# Altium schematic sheet 02 - Power Stage.SchDoc: Power Stage - 25kW WolfPACK FM3 Six-Pack Inv.
size 431 x 279 mm; Date: 07/2023; DocumentNumber: CRD25DA12N-FMC; Revision: 1.1; SheetNumber: 2; SheetTotal: 8; SheetSize: B
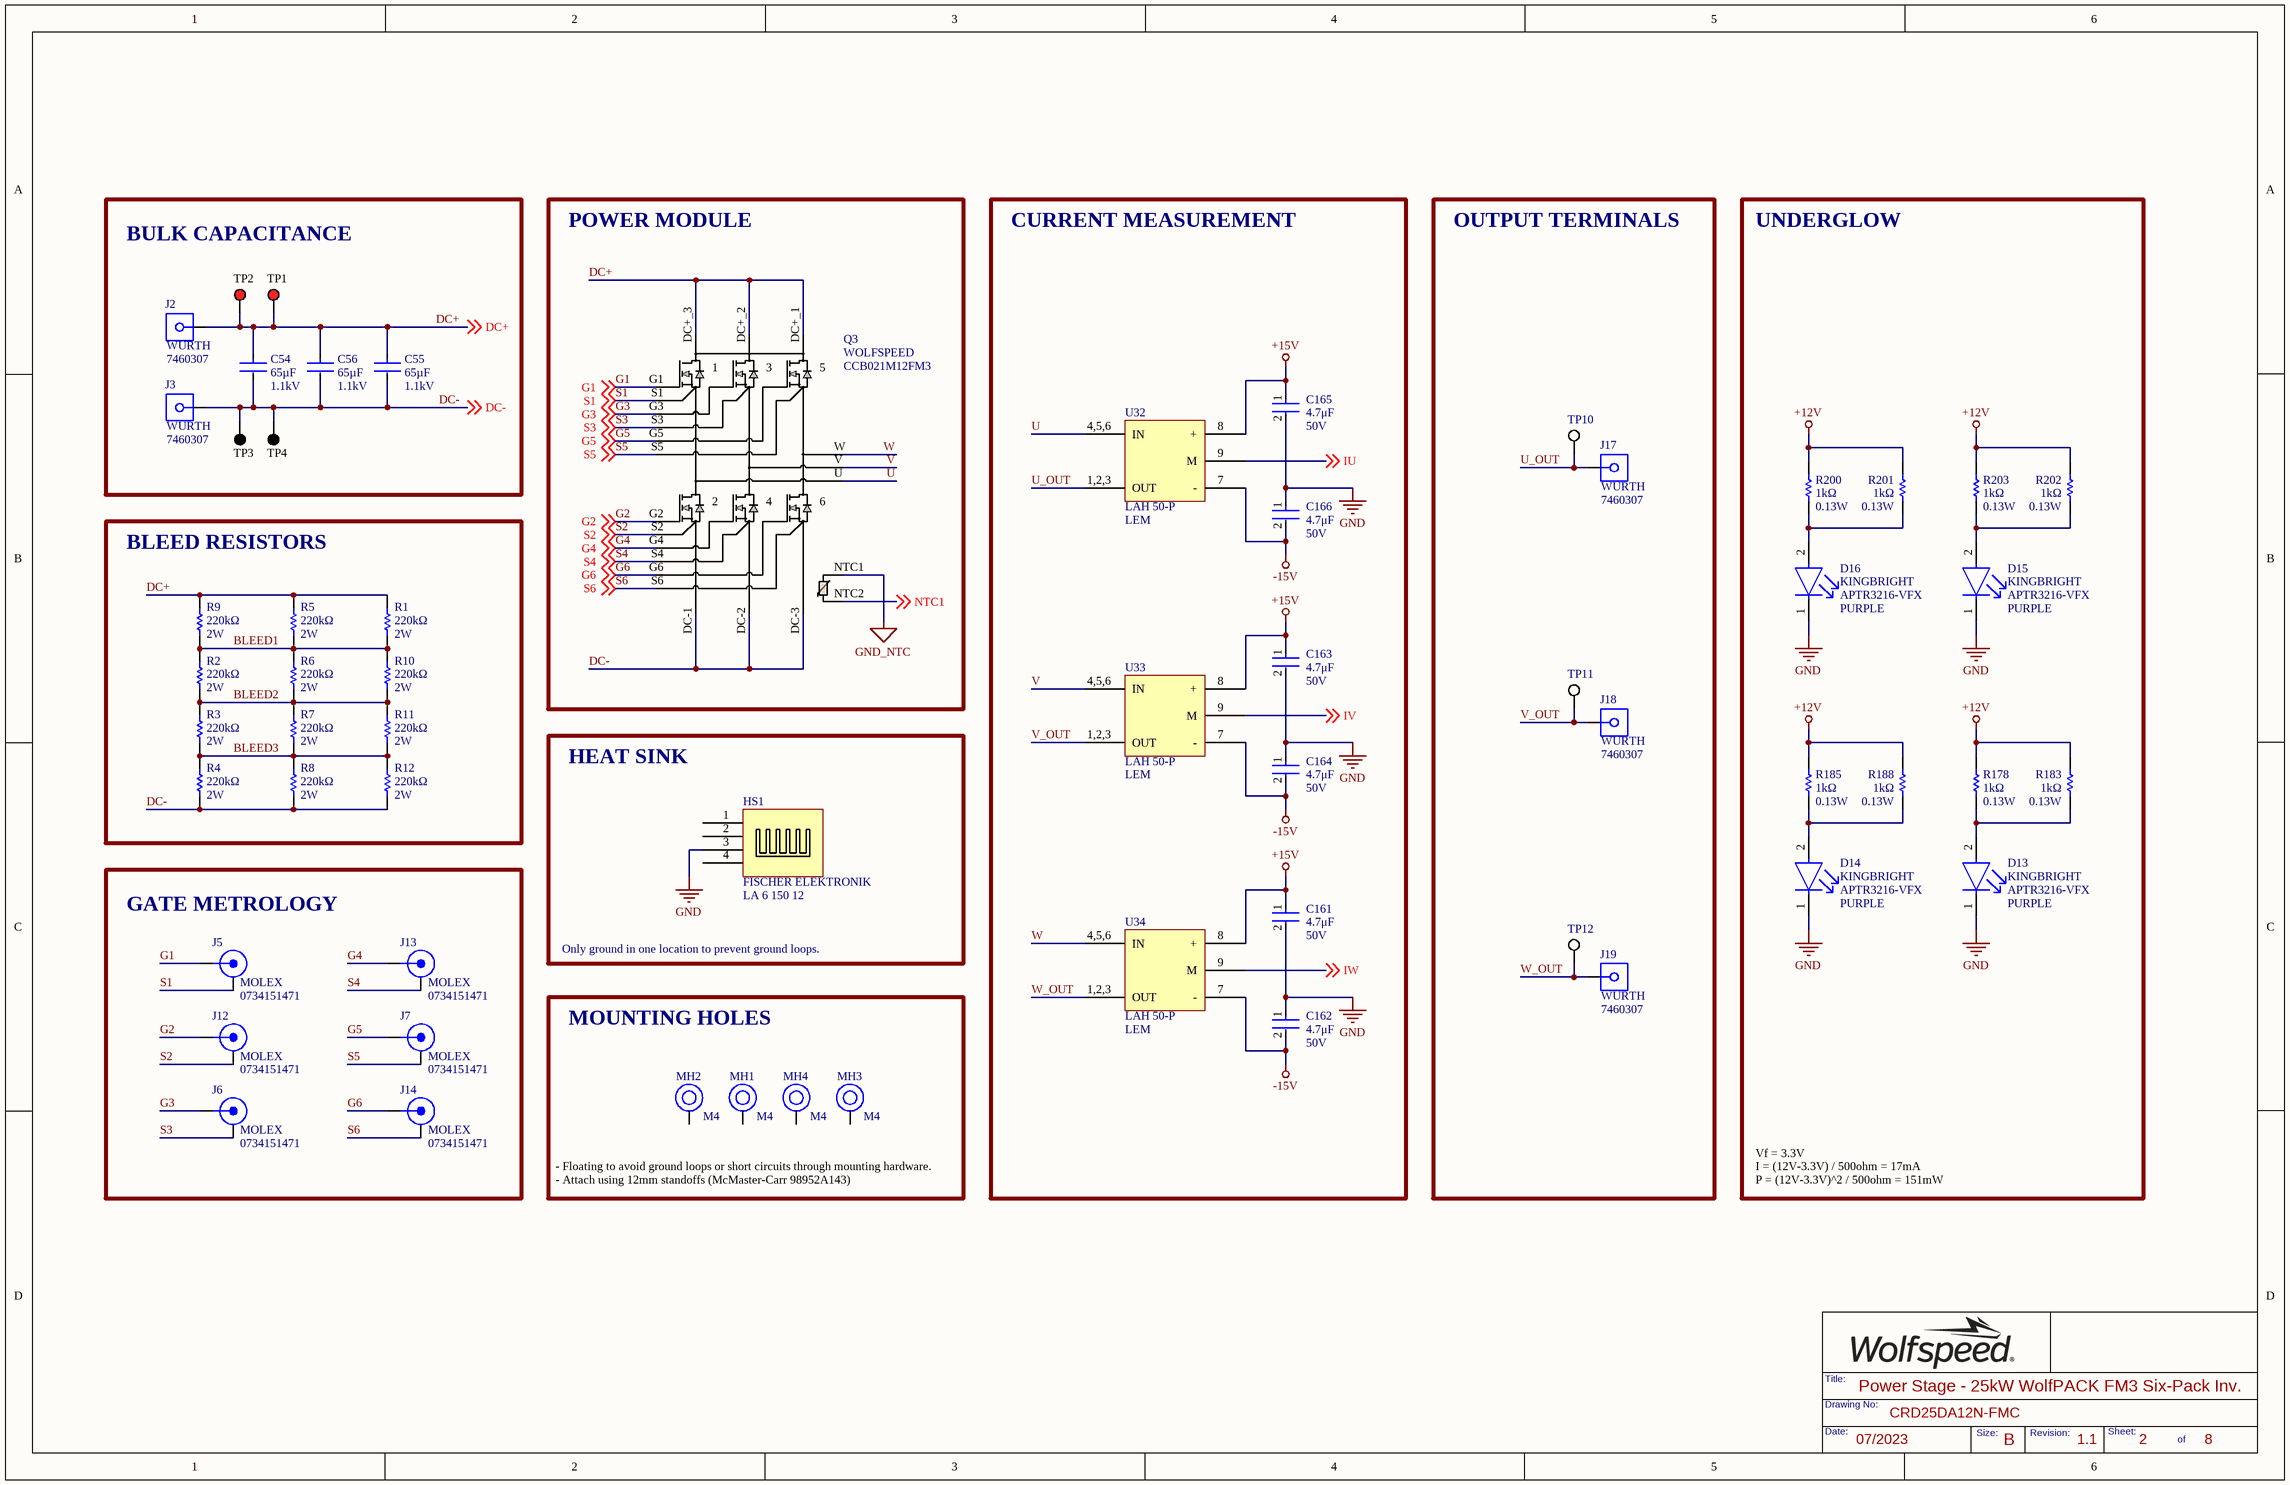
[diagram p0: 02 - Power Stage.SchDoc]

## Parts
C54  Voltage: 1.1kV  Capacitance: 65µF  [C4AQQEW5650A3BJ]  (hidden comment: C4AQQEW5650A3BJ)
C55  Voltage: 1.1kV  Capacitance: 65µF  [C4AQQEW5650A3BJ]  (hidden comment: C4AQQEW5650A3BJ)
C56  Voltage: 1.1kV  Capacitance: 65µF  [C4AQQEW5650A3BJ]  (hidden comment: C4AQQEW5650A3BJ)
C161  Voltage Rating: 50V  Capacitance: 4.7μF  [FP-CL31-IPC_C]  (hidden comment: CL31B475KBHNFNE)
C162  Voltage Rating: 50V  Capacitance: 4.7μF  [FP-CL31-IPC_C]  (hidden comment: CL31B475KBHNFNE)
C163  Voltage Rating: 50V  Capacitance: 4.7μF  [FP-CL31-IPC_C]  (hidden comment: CL31B475KBHNFNE)
C164  Voltage Rating: 50V  Capacitance: 4.7μF  [FP-CL31-IPC_C]  (hidden comment: CL31B475KBHNFNE)
C165  Voltage Rating: 50V  Capacitance: 4.7μF  [FP-CL31-IPC_C]  (hidden comment: CL31B475KBHNFNE)
C166  Voltage Rating: 50V  Capacitance: 4.7μF  [FP-CL31-IPC_C]  (hidden comment: CL31B475KBHNFNE)
D13  Manufacturer Print: KINGBRIGHT  Color: PURPLE  [FP-APTR3216SECK-MFG]  (hidden comment: APTR3216-VFX)
D14  Manufacturer Print: KINGBRIGHT  Color: PURPLE  [FP-APTR3216SECK-MFG]  (hidden comment: APTR3216-VFX)
D15  Manufacturer Print: KINGBRIGHT  Color: PURPLE  [FP-APTR3216SECK-MFG]  (hidden comment: APTR3216-VFX)
D16  Manufacturer Print: KINGBRIGHT  Color: PURPLE  [FP-APTR3216SECK-MFG]  (hidden comment: APTR3216-VFX)
HS1  LA 6 150 12  Manufacturer: FISCHER ELEKTRONIK  [LA 6 150 12]
J2  Manufacturer Print: WURTH  [7460307]  (hidden comment: 7460307)
J3  Manufacturer Print: WURTH  [7460307]  (hidden comment: 7460307)
J5  0734151471  Manufacturer Print: MOLEX  [FP-73415-1471-MFG]
J6  0734151471  Manufacturer Print: MOLEX  [FP-73415-1471-MFG]
J7  0734151471  Manufacturer Print: MOLEX  [FP-73415-1471-MFG]
J12  0734151471  Manufacturer Print: MOLEX  [FP-73415-1471-MFG]
J13  0734151471  Manufacturer Print: MOLEX  [FP-73415-1471-MFG]
J14  0734151471  Manufacturer Print: MOLEX  [FP-73415-1471-MFG]
J17  Manufacturer Print: WURTH  [7460307]  (hidden comment: 7460307)
J18  Manufacturer Print: WURTH  [7460307]  (hidden comment: 7460307)
J19  Manufacturer Print: WURTH  [7460307]  (hidden comment: 7460307)
MH1  Size: M4  [MH_M4_P]  (hidden comment: MH_M4_P)
MH2  Size: M4  [MH_M4_P]  (hidden comment: MH_M4_P)
MH3  Size: M4  [MH_M4_P]  (hidden comment: MH_M4_P)
MH4  Size: M4  [MH_M4_P]  (hidden comment: MH_M4_P)
Q3  CCB021M12FM3  Manufacturer Print: WOLFSPEED  [FM3_SIX-PACK_3PHASE_CRW]
R1  Power Rating: 2W  Resistance: 220kΩ  [FP-CRGP2512-IPC_C]  (hidden comment: CRGP2512F220K)
R2  Power Rating: 2W  Resistance: 220kΩ  [FP-CRGP2512-IPC_C]  (hidden comment: CRGP2512F220K)
R3  Power Rating: 2W  Resistance: 220kΩ  [FP-CRGP2512-IPC_C]  (hidden comment: CRGP2512F220K)
R4  Power Rating: 2W  Resistance: 220kΩ  [FP-CRGP2512-IPC_C]  (hidden comment: CRGP2512F220K)
R5  Power Rating: 2W  Resistance: 220kΩ  [FP-CRGP2512-IPC_C]  (hidden comment: CRGP2512F220K)
R6  Power Rating: 2W  Resistance: 220kΩ  [FP-CRGP2512-IPC_C]  (hidden comment: CRGP2512F220K)
R7  Power Rating: 2W  Resistance: 220kΩ  [FP-CRGP2512-IPC_C]  (hidden comment: CRGP2512F220K)
R8  Power Rating: 2W  Resistance: 220kΩ  [FP-CRGP2512-IPC_C]  (hidden comment: CRGP2512F220K)
R9  Power Rating: 2W  Resistance: 220kΩ  [FP-CRGP2512-IPC_C]  (hidden comment: CRGP2512F220K)
R10  Power Rating: 2W  Resistance: 220kΩ  [FP-CRGP2512-IPC_C]  (hidden comment: CRGP2512F220K)
R11  Power Rating: 2W  Resistance: 220kΩ  [FP-CRGP2512-IPC_C]  (hidden comment: CRGP2512F220K)
R12  Power Rating: 2W  Resistance: 220kΩ  [FP-CRGP2512-IPC_C]  (hidden comment: CRGP2512F220K)
R178  Resistance: 1kΩ  Power Rating: 0.13W  [RESC2013X50X30LL20T20]  (hidden comment: CRCW08051K00JNTA)
R183  Resistance: 1kΩ  Power Rating: 0.13W  [RESC2013X50X30LL20T20]  (hidden comment: CRCW08051K00JNTA)
R185  Resistance: 1kΩ  Power Rating: 0.13W  [RESC2013X50X30LL20T20]  (hidden comment: CRCW08051K00JNTA)
R188  Resistance: 1kΩ  Power Rating: 0.13W  [RESC2013X50X30LL20T20]  (hidden comment: CRCW08051K00JNTA)
R200  Resistance: 1kΩ  Power Rating: 0.13W  [RESC2013X50X30LL20T20]  (hidden comment: CRCW08051K00JNTA)
R201  Resistance: 1kΩ  Power Rating: 0.13W  [RESC2013X50X30LL20T20]  (hidden comment: CRCW08051K00JNTA)
R202  Resistance: 1kΩ  Power Rating: 0.13W  [RESC2013X50X30LL20T20]  (hidden comment: CRCW08051K00JNTA)
R203  Resistance: 1kΩ  Power Rating: 0.13W  [RESC2013X50X30LL20T20]  (hidden comment: CRCW08051K00JNTA)
TP1  5010  [KSTN-5010_V]  (value not drawn)
TP2  5010  [KSTN-5010_V]  (value not drawn)
TP3  5011  [KSTN-5011_V]  (value not drawn)
TP4  5011  [KSTN-5011_V]  (value not drawn)
TP10  5012  [KSTN-5012_V]  (value not drawn)
TP11  5012  [KSTN-5012_V]  (value not drawn)
TP12  5012  [KSTN-5012_V]  (value not drawn)
U32  LAH 50-P  Manufacturer Print: LEM  [LAH 50-P]
U33  LAH 50-P  Manufacturer Print: LEM  [LAH 50-P]
U34  LAH 50-P  Manufacturer Print: LEM  [LAH 50-P]

## Blocks framed on the sheet
BULK CAPACITANCE: C54-C56 J2 J3 TP1-TP4
POWER MODULE: Q3
CURRENT MEASUREMENT: C161-C166 U32-U34
OUTPUT TERMINALS: J17-J19 TP10-TP12
UNDERGLOW: D13-D16 R178 R183 R185 R188 R200-R203
BLEED RESISTORS: R1-R12
HEAT SINK: HS1
GATE METROLOGY: J5-J7 J12-J14
MOUNTING HOLES: MH1-MH4

## Nets
+12V: R178.2 R183.2 R185.2 R188.2 R200.2 R201.2 R202.2 R203.2
+15V: C161.1 C163.1 C165.1 U32.8(+) U33.8(+) U34.8(+)
-15V: C162.2 C164.2 C166.2 U32.7(-) U33.7(-) U34.7(-)
GND: C161.2 C162.1 C163.2 C164.1 C165.2 C166.1 D13.1(C) D14.1(C) D15.1(C) D16.1(C) HS1.3
GND_NTC: Q3.NTC1
BLEED1: R1.1 R2.2 R5.1 R6.2 R9.1 R10.2
BLEED2: R2.1 R3.2 R6.1 R7.2 R10.1 R11.2
BLEED3: R3.1 R4.2 R7.1 R8.2 R11.1 R12.2
DC+: C54.1,2(+) C55.1,2(+) C56.1,2(+) J2.1,2,3,4,5,6,7,8 Q3.DC+_1 Q3.DC+_2 Q3.DC+_3 R1.2 R5.2 R9.2 TP1.1 TP2.1 ; off-sheet DC+
DC-: C54.3,4 C55.3,4 C56.3,4 J3.1,2,3,4,5,6,7,8 Q3.DC-1 Q3.DC-2 Q3.DC-3 R4.1 R8.1 R12.1 TP3.1 TP4.1 ; off-sheet DC-
G1: J5.1(CENTER) Q3.G1 ; off-sheet G1
G2: J12.1(CENTER) Q3.G2 ; off-sheet G2
G3: J6.1(CENTER) Q3.G3 ; off-sheet G3
G4: J13.1(CENTER) Q3.G4 ; off-sheet G4
G5: J7.1(CENTER) Q3.G5 ; off-sheet G5
G6: J14.1(CENTER) Q3.G6 ; off-sheet G6
IU: U32.9(M) ; off-sheet IU
IV: U33.9(M) ; off-sheet IV
IW: U34.9(M) ; off-sheet IW
NTC1: Q3.NTC2 ; off-sheet NTC1
S1: J5.2,3,4,5(SHIELD) Q3.S1 ; off-sheet S1
S2: J12.2,3,4,5(SHIELD) Q3.S2 ; off-sheet S2
S3: J6.2,3,4,5(SHIELD) Q3.S3 ; off-sheet S3
S4: J13.2,3,4,5(SHIELD) Q3.S4 ; off-sheet S4
S5: J7.2,3,4,5(SHIELD) Q3.S5 ; off-sheet S5
S6: J14.2,3,4,5(SHIELD) Q3.S6 ; off-sheet S6
U: Q3.U U32.4,5,6(IN)
U_OUT: J17.1,2,3,4,5,6,7,8 TP10.1 U32.1,2,3(OUT)
V: Q3.V U33.4,5,6(IN)
V_OUT: J18.1,2,3,4,5,6,7,8 TP11.1 U33.1,2,3(OUT)
W: Q3.W U34.4,5,6(IN)
W_OUT: J19.1,2,3,4,5,6,7,8 TP12.1 U34.1,2,3(OUT)
NetD13_2: D13.2(A) R178.1 R183.1
NetD14_2: D14.2(A) R185.1 R188.1
NetD15_2: D15.2(A) R202.1 R203.1
NetD16_2: D16.2(A) R200.1 R201.1

Not connected (* = marked no-connect by the designer): HS1 1 2 4; MH1 1; MH2 1; MH3 1; MH4 1

## Notes on the sheet
- Only ground in one location to prevent ground loops.
- - Floating to avoid ground loops or short circuits through mounting hardware.
  - Attach using 12mm standoffs (McMaster-Carr 98952A143)
- Vf = 3.3V
  I = (12V-3.3V) / 500ohm = 17mA
  P = (12V-3.3V)^2 / 500ohm = 151mW
- Title:
- Date:
- Drawing No:
- Size:
- Revision:
- Sheet:
- of
- (in symbol CCB021M12FM3) 1; 3; 5; 2; 4; 6

## Library data of the parts
C54-C56 = C4AQQEW5650A3BJ: CAP FILM 65UF 5% 1.1KVDC RAD; Manufacturer: KEMET; Value: 65µF; Supplier 1: Digi-Key; Manufacturer Part Number: C4AQQEW5650A3BJ; RoHS: Yes; Category: Film Capacitors; Stock 1: 1080; Pricing 1: 1=19.26000, 10=18.24800, 50=15.71360, 100=14.69980, 500=13.17910 (USD); RoHS Compliant: No; Supplier Part Number 1: 399-C4AQQEW5650A3BJ-ND; Package: RADIAL
C161-C166 = CMP-13271-001123-1: CAP CER 4.7UF 50V X7R 1206; Manufacturer: SAMSUNG; Tolerance: 10%; Value: 4.7μF; Depth: 1.6mm; Max Operating Temperature: 125°C; Case Code (Metric): 3216; Packaging: Tape and Reel; Mount: Surface Mount; Min Operating Temperature: -55°C; Thickness: 0.071inch; Package: 1206; Length: 3.2mm; Dielectric: X7R; Case Code (Imperial): 1206; Height: 1.6mm; Package Quantity: 1; Radiation Hardening: No; Width: 0.063inch; Manufacturer Part Number: CL31B475KBHNFNE
D13-D16 = APTR3216-VFX: LED PURPLE CLEAR 1206 SMD; Supplier 1: Mouser; Manufacturer: Kingbright; RoHS: Yes; Category: LEDs; Stock 1: 19947; Pricing 1: 1=0.84000, 10=0.55000, 50=0.55000, 100=0.36100, 1000=0.28500, 10000=0.25200 (USD); RoHS Compliant: Yes; Supplier Part Number 1: 604-APTR3216-VFX; Manufacturer Part Number: APTR3216-VFX; Value: PURPLE; Package: 1206
HS1 = LA 6 150 12: HEATSINK EXTRUSION 150MM; Manufacturer Part Number: LA6/15012V; Natural Thermal Resistance: 0.175°C/W; Power Consumption: 2.9W; Supplier 1: Newark; RoHS: Yes; Category: Uncategorized; Stock 1: 135; Pricing 1: 1=128.57000, 10=109.67000, 25=105.17000, 50=100.26000, 100=91.40000, 250=79.15000 (USD); Weight: 66g; Material: Aluminium; Length: 150mm; Reach SVHC Compliant: Yes; ComponentLink1URL: https://datasheet.ciiva.com/14098/fmfischer-lufteraggregat-la6-en-14098709.pdf?src-supplier=Distrelec; ComponentLink1Description: https://datasheet.ciiva.com/14098/fmfischer-lufteraggregat-la6-en-14098709.pdf?src-supplier=Distrelec; ComponentLink2URL: https://datasheet.ciiva.com/1609/17634-1609751.pdf?src-supplier=Element14; ComponentLink2Description: https://datasheet.ciiva.com/1609/17634-1609751.pdf?src-supplier=Element14; Supplier Part Number 1: 42M1958; Package: N/A; Value: N/A
J2 J3 J17-J19 = 7460307: TERM REDCUBE M4 8PIN PCB; Manufacturer: WURTH ELEKTRONIK; Current Rating: 80A; Number of Contacts: 8; Insulation: Non-Insulated; Supplier 1: Rs; RoHS: Yes; Category: Terminals; Stock 1: 1875; Mount: Through Hole; Number of Pins: 8; Contact Material: Copper; Contact Plating: Tin; Min Operating Temperature: -40°C; Max Operating Temperature: 135°C; Packaging: Bulk; Package Quantity: 250; Number of Rows: 2; Termination: Press-Fit; Series: REDCUBE WP-BUTR; Length: 9mm; Width: 9mm; Height: 10.5mm; Thread Size: M4; RoHS Compliant: Yes; ComponentLink1URL: https://datasheet.ciiva.com/8043/1736661-8043578.pdf?src-supplier=Element14; ComponentLink1Description: https://datasheet.ciiva.com/8043/1736661-8043578.pdf?src-supplier=Element14; ComponentLink2URL: https://datasheet.ciiva.com/13538/powerelements20with20220row20pin20plate-13538549.pdf?src-supplier=Mouser; ComponentLink2Description: https://datasheet.ciiva.com/13538/powerelements20with20220row20pin20plate-13538549.pdf?src-supplier=Mouser; ComponentLink3URL: https://datasheet.ciiva.com/23814/606286-23814304.pdf?src-supplier=Newark; ComponentLink3Description: https://datasheet.ciiva.com/23814/606286-23814304.pdf?src-supplier=Newark; ComponentLink4URL: https://datasheet.ciiva.com/847/bushes-847081.pdf?src-supplier=Digi-Key; ComponentLink4Description: https://datasheet.ciiva.com/847/bushes-847081.pdf?src-supplier=Digi-Key; Supplier Part Number 1: 1224952; Manufacturer Part Number: 7460307; Value: N/A; Package: N/A
J5-J7 J12-J14 = 0734151471: CONN MMCX JACK STR 50 OHM PCB; Manufacturer Part Number: 73415-1471; Body Material: Brass; Body Plating: Gold; Impedance: 50R; Connector Type: PCB,MMCX,Coaxial; Max Frequency: 6GHz; Gender: Female; Supplier 1: Allied Electronics; Manufacturer: MOLEX; RoHS: Yes; Category: RF / Coaxial Connectors; Stock 1: 18; Pricing 1: 1=2.94000, 5=2.79000, 100=2.65000 (USD); Mount: Through Hole; Contact Material: Copper; Contact Plating: Gold; Insulation Material: Teflon; Plating: Gold; Packaging: Bulk; Package Quantity: 500; Termination: Solder; Orientation: Straight; Series: 73415; Operating Frequency: N/A; Length: 3.51mm; Depth: 3.51mm; Radiation Hardening: No; RoHS Compliant: Yes; Lead Free: Lead Free; Halogen Free: Low Halogen; Supplier Part Number 1: 70364031; Value: N/A; Package: N/A
MH1-MH4 = MH_M4_P: HEX STANDOFF M4 ALUMINUM 51MM F-F; Manufacturer: MCMASTER-CARR; Manufacturer Part Number: 95947A552; Package: N/A; Value: N/A
Q3 = CCB021M12FM3: 1200V silicon carbide six-pack power module delivering maximum power density; Mfr_Name: Cree Wolfspeed; Type: DEV; Copyright: Copyright (C) 2021 Ultra Librarian. All rights reserved.; Manufacturer_Part_Number: CCB021M12FM3; RefDes: RefDes; Supplier 1: Arrow Electronics; Manufacturer: WOLFSPEED; Manufacturer Part Number: CCB021M12FM3; RoHS: No; Category: MOSFETs; Stock 1: 52; Pricing 1: 1=248.05500, 10=245.57100, 25=243.75400, 50=241.29300, 100=238.84350, 500=236.39400 (USD); Supplier Part Number 1: CCB021M12FM3; Package: FMC; Value: N/A
R1-R12 = CMP-03211-002966-1: RES 220K OHM 1% 2W 2512; Manufacturer: TE; Value: 220kΩ; Temperature Coefficient: ±100ppm/°C; Tolerance: 0.01; Voltage Rating: 500V; Device Class L1: Passive Components; RoHS: TRUE; ComponentLink2Description: Datasheet; Series: CRGP; ComponentLink2URL: https://www.mouser.ca/datasheet/2/418/NG_DS_9-1773463-9_A-1358566.pdf; Octopart: https://octopart.com/crgp2512f220k-te+connectivity-91019045; Height: 0.65mm; Composition: Thick Film; Ambient Temperature Range High: +70°C; Temperature Range High: +155°C; Automotive: No; Category: Res; Lead Free: Yes; Device Class L3: Chip SMD Resistors; Ipc Land Pattern Name: RESC635320X55; Temperature Range Low: -55°C; Manufacturer Part Number: CRGP2512F220K; Temperature: -55°C to +155°C; Device Class L2: Resistors; Package: 2512
R178 R183 R185 R188 R200-R203 = CRCW08051K00JNTA: RES SMD 1K OHM 5% 1/8W 0805; Manufacturer: VISHAY DALE; Temperature Coefficient: 200ppm/°C; Max Power Dissipation: 125mW; Voltage Rating: 150V; Value: 1kΩ; Supplier 1: Avnet; Manufacturer Part Number: CRCW08051K00JNTA; RoHS: No; Category: Chip SMD Resistors; Stock 1: 20000; Pricing 1: 5000=0.03087, 10000=0.02988, 20000=0.02889, 30000=0.02790, 40000=0.02682, 50000=0.02556, 500000=0.02430 (USD); Package: 0805; Case Code (Imperial): 0805; Case Code (Metric): 2012; Contact Plating: Tin,Lead; Weight: 0.000194oz; Min Operating Temperature: -55°C; Max Operating Temperature: 155°C; Packaging: Tape and Reel; Tolerance: 5%; Series: CRCW; Resistor Type: Thick Film; Package Quantity: 5000; Number of Terminations: 2; Voltage Rating (DC): 150V; Construction: Rectangular; Features: Automotive AEC-Q200; Power Dissipation: 125mW; Length: 2mm; Width: 1.25mm; Height: 0.02inch; Depth: 1.25mm; Radiation Hardening: No; RoHS Compliant: No; Lead Free: Contains Lead; Military Standard: Not; ComponentLink1URL: https://datasheet.ciiva.com/2565/dcrcw-2565721.pdf?src-supplier=Digi-Key; ComponentLink1Description: https://datasheet.ciiva.com/2565/dcrcw-2565721.pdf?src-supplier=Digi-Key; Supplier Part Number 1: CRCW08051K00JNTA
TP1 TP2 = CMP-1672-00002-4: PC TEST POINT MULTIPURPOSE RED; Manufacturer: KEYSTONE; Contact Material: Bronze; Mounting Technology: Through Hole; RoHSCompliant: true; Pins: 1; Package Quantity: 100; ComponentLink2Description: Datasheet; Height: 8.12 mm; ComponentLink1URL: http://www.keyelco.com/; DatasheetVersion: Rev. F, 12/2013; Mount: Through Hole; PackageReference: 5010; Contact Plating: Silver; Packaging: Bulk; Colour: Red; REACH SVHC: No SVHC; PackageDescription: 1-Pin Through Hole Device, Dia 3.17 mm; ComponentLink2URL: http://www.keyelco.com/product-pdf.cfm?p=1319; ComponentLink1Description: Manufacturer URL; Manufacturer Part Number: 5010; Value: RED; Package: N/A
TP3 TP4 = CMP-1672-00003-4: PC TEST POINT MULTIPURPOSE BLACK; Manufacturer: KEYSTONE; ComponentLink2URL: http://www.keyelco.com/product-pdf.cfm?p=1320; Colour: Black; Pins: 1; REACH SVHC: No SVHC; ComponentLink1URL: http://www.keyelco.com/; PackageReference: 5011; Contact Plating: Silver; Package Quantity: 100; Packaging: Bulk; RoHSCompliant: true; Height: 8.12 mm; PackageDescription: 1-Pin Through Hole Device, Dia 3.17 mm; Mount: Through Hole; Mounting Technology: Through Hole; DatasheetVersion: Rev. F, 12/2013; ComponentLink1Description: Manufacturer URL; Contact Material: Bronze; ComponentLink2Description: Datasheet; Manufacturer Part Number: 5011; Value: BLACK; Package: N/A
TP10-TP12 = CMP-1672-00004-4: PC TEST POINT MULTIPURPOSE WHITE; Manufacturer: KEYSTONE; DatasheetVersion: Rev. F, 12/2013; ComponentLink1URL: http://www.keyelco.com/; PackageReference: 5012; RoHSCompliant: true; ComponentLink2Description: Datasheet; Colour: White; Contact Material: Bronze; PackageDescription: 1-Pin Through Hole Device, Dia 3.17 mm; Mounting Technology: Through Hole; Mount: Through Hole; Package Quantity: 100; ComponentLink1Description: Manufacturer URL; Pins: 1; Height: 8.12 mm; Packaging: Bulk; REACH SVHC: No SVHC; Contact Plating: Silver; Length: 11.3 mm; ComponentLink2URL: http://www.keyelco.com/product-pdf.cfm?p=1321; Value: WHITE; Package: N/A; Manufacturer Part Number: 5012
U32-U34 = LAH 50-P: SENSOR CURRENT HALL 50A AC/DC; Frequency: 200kHz; Number of Channels: 1; Response Time: 0.5us; Max Supply Current: 35mA; Polarity: Bidirectional; Linearity: 0.15%; Accuracy: 0.25%; Operating Supply Voltage: 15V; Secondary Current: 25mA; Overall Height: 21mm; Overall Depth: 14.93mm; Supplier 1: Newark; Manufacturer: LEM; Manufacturer Part Number: LAH 50-P; RoHS: Yes; Category: Current Sensors; Stock 1: 776; Pricing 1: 1=22.98000, 10=21.60000, 25=20.67000 (USD); Mount: Through Hole,PCB; Case/Package: Module; Min Operating Temperature: -25°C; Max Operating Temperature: 85°C; Package Quantity: 12; Packaging: Bulk; Current Sensing: 50A; Series: LAH; Current Rating: 50A; Width: 33.3mm; Height: 21mm; RoHS Compliant: Yes; Lead Free: Lead Free; Reach SVHC Compliant: Yes; ComponentLink1URL: https://datasheet.ciiva.com/2812/lah2050-p20e-2812498.pdf?src-supplier=Digi-Key; ComponentLink1Description: https://datasheet.ciiva.com/2812/lah2050-p20e-2812498.pdf?src-supplier=Digi-Key; ComponentLink2URL: https://datasheet.ciiva.com/3327/lah50p-eng-tds-3327447.pdf?src-supplier=Distrelec; ComponentLink2Description: https://datasheet.ciiva.com/3327/lah50p-eng-tds-3327447.pdf?src-supplier=Distrelec; Supplier Part Number 1: 44W8442; Value: N/A; Package: N/A